# Altium schematic sheet Sheet1.SchDoc
size A2
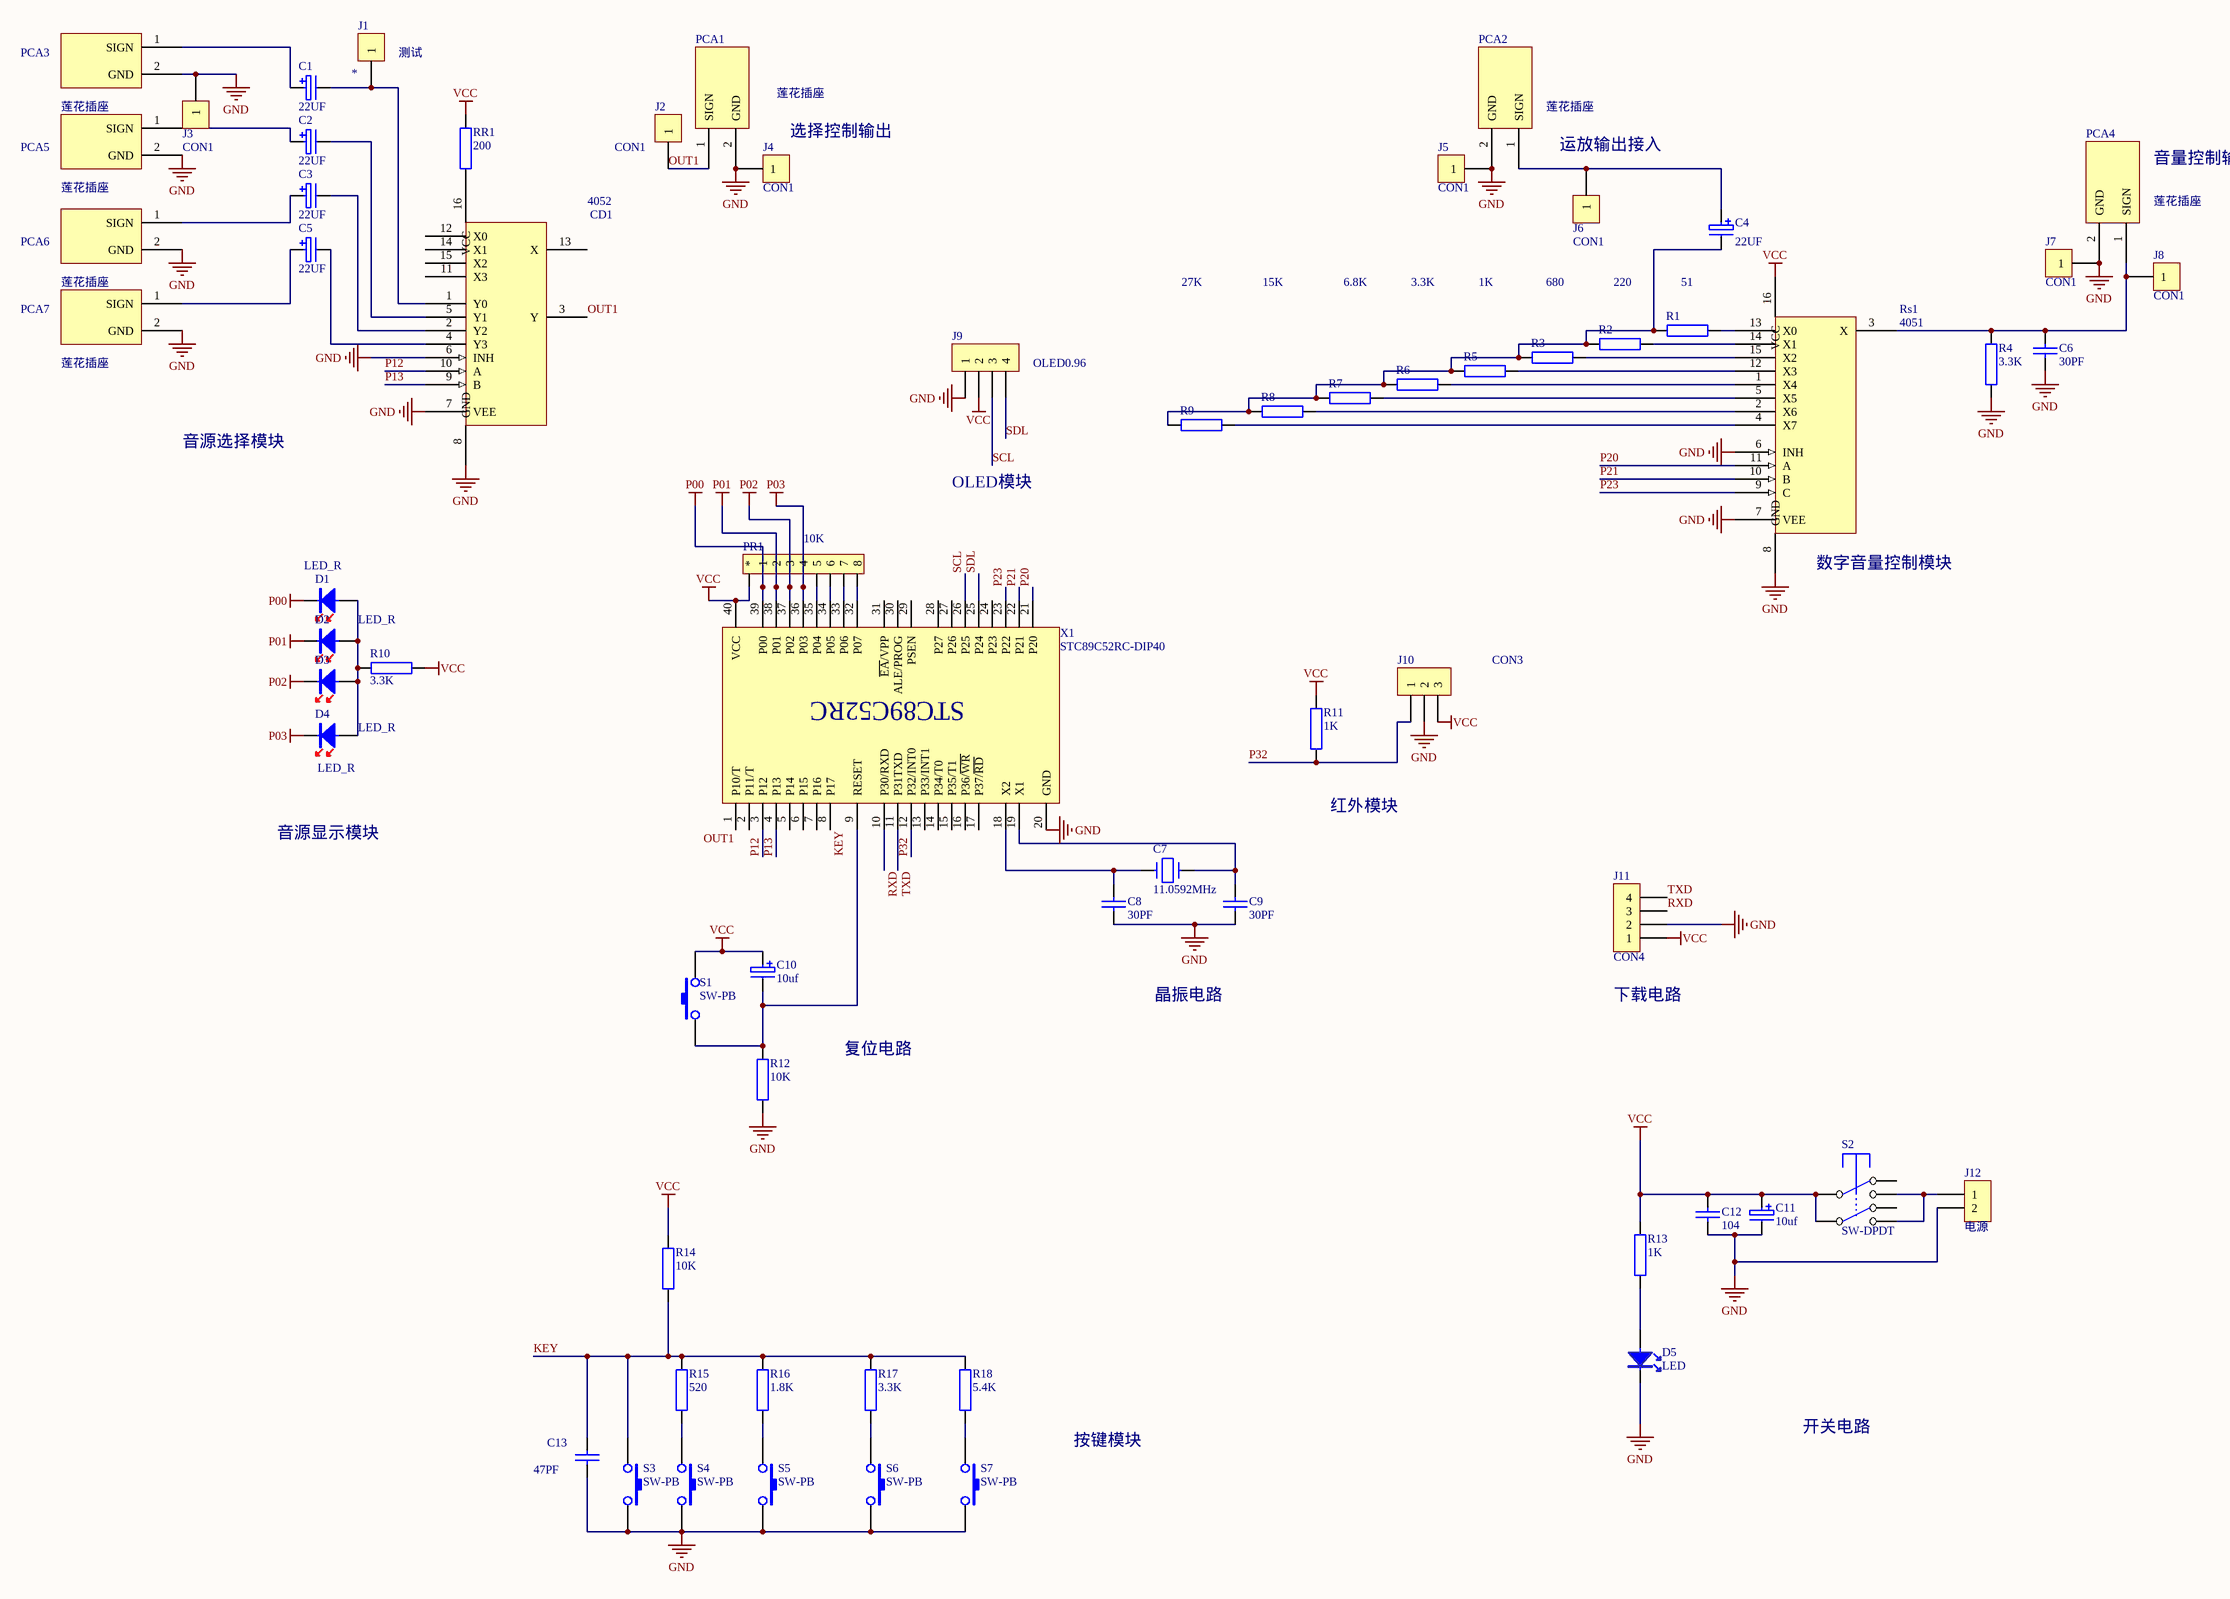
[diagram p0: Sheet1.SchDoc]

## Parts
C1  22UF  [CAO2]
C2  22UF  [CAO2]
C3  22UF  [CAO2]
C4  22UF  [CAO2]
C5  22UF  [CAO2]
C6  30PF  [CAP2]
C7  11.0592MHz  [XTAL1]
C8  30PF  [CAP2]
C9  30PF  [CAP2]
C10  10uf  [CAO2]
C11  10uf  [CAO2]
C12  104  [CAP2]
C13  47PF  [CAP2]
CD1  4052  [SO-16]
D1  LED_R  [LED2_B]
D2  LED_R  [LED2_B]
D3  LED_R  [LED2_B]
D4  LED_R  [LED2_B]
D5  LED  [LED2_B]
J1  *  [SIP-1]
J2  CON1  [SIP-1]
J3  CON1  [SIP-1]
J4  CON1  [SIP-1]
J5  CON1  [SIP-1]
J6  CON1  [SIP-1]
J7  CON1  [SIP-1]
J8  CON1  [SIP-1]
J9  OLED0.96  [sip-4]
J10  CON3  [sip-3]
J11  CON4  [sip-4]
J12  电源  [接线端子]
PCA1  莲花插座  [莲花母座]
PCA2  莲花插座  [莲花母座]
PCA3  莲花插座  [莲花母座]
PCA4  莲花插座  [莲花母座]
PCA5  莲花插座  [莲花母座]
PCA6  莲花插座  [莲花母座]
PCA7  莲花插座  [莲花母座]
PR1  10K  [RP1]
R1  51  [AXIAL0.4]
R2  220  [AXIAL0.4]
R3  680  [AXIAL0.4]
R4  3.3K  [AXIAL0.4]
R5  1K  [AXIAL0.4]
R6  3.3K  [AXIAL0.4]
R7  6.8K  [AXIAL0.4]
R8  15K  [AXIAL0.4]
R9  27K  [AXIAL0.4]
R10  3.3K  [AXIAL0.4]
R11  1K  [AXIAL0.4]
R12  10K  [AXIAL0.4]
R13  1K  [AXIAL0.4]
R14  10K  [AXIAL0.4]
R15  520  [AXIAL0.4]
R16  1.8K  [AXIAL0.4]
R17  3.3K  [AXIAL0.4]
R18  5.4K  [AXIAL0.4]
RR1  200  [AXIAL0.4]
Rs1  4051  [SO-16]
S1  SW-PB  [SW6*6]
S2  SW-DPDT  [SWH8*8]
S3  SW-PB  [SW6*6]
S4  SW-PB  [SW6*6]
S5  SW-PB  [SW6*6]
S6  SW-PB  [SW6*6]
S7  SW-PB  [SW6*6]
X1  STC89C52RC-DIP40  [DIP-40]

## Nets
GND: C6.2 C8.2 C9.2 C11.2 C12.2 C13.2 CD1.6(INH) CD1.7(VEE) CD1.8(GND) D5.2 J3.1 J4.1 J5.1 J7.1 J9.1 J10.2 J11.2 J12.2 PCA1.2(GND) PCA2.2(GND) PCA3.2(GND) PCA4.2(GND) PCA5.2(GND) PCA6.2(GND) PCA7.2(GND) R4.1 R12.1 Rs1.6(INH) Rs1.7(VEE) Rs1.8(GND) S3.2 S4.2 S5.2 S6.2 S7.2 X1.20(GND)
P00: D1.2 PR1.2(1) X1.39(P00)
P01: D2.2 PR1.3(2) X1.38(P01)
P02: D3.2 PR1.4(3) X1.37(P02)
P03: D4.2 PR1.5(4) X1.36(P03)
VCC: C10.1 C11.1 C12.1 J9.2 J10.3 J11.1 PR1.1 R10.1 R11.2 R13.2 R14.2 RR1.1 Rs1.16(VCC) S1.2 S2.2 S2.5 X1.40(VCC)
KEY: C13.1 R14.1 R15.2 R16.2 R17.2 R18.2 S3.1 X1.8(P17)
OUT1: CD1.3(Y) J2.1 PCA1.1(SIGN) X1.1(P10/T)
P12: CD1.10(A) X1.3(P12)
P13: CD1.9(B) X1.4(P13)
P20: Rs1.11(A) X1.21(P20)
P21: Rs1.10(B) X1.22(P21)
P23: Rs1.9(C) X1.23(P22)
P32: J10.1 R11.1 X1.12(P32/INT0)
RXD: J11.3 X1.10(P30/RXD)
SCL: J9.3 X1.26(P25)
SDL: J9.4 X1.25(P24)
TXD: J11.4 X1.11(P31TXD)
NetC1_1: C1.1 PCA3.1(SIGN)
NetC1_2: C1.2 CD1.1(Y0) J1.1
NetC2_1: C2.1 PCA5.1(SIGN)
NetC2_2: C2.2 CD1.5(Y1)
NetC3_1: C3.1 PCA6.1(SIGN)
NetC3_2: C3.2 CD1.2(Y2)
NetC4_1: C4.1 J6.1 PCA2.1(SIGN)
NetC4_2: C4.2 R1.1 R2.1 R3.1 R5.1 R6.1 R7.1 R8.1 R9.1
NetC5_1: C5.1 PCA7.1(SIGN)
NetC5_2: C5.2 CD1.4(Y3)
NetC6_1: C6.1 J8.1 PCA4.1(SIGN) R4.2 Rs1.3(X)
NetC7_1: C7.1 C8.1 X1.18(X2)
NetC7_2: C7.2 C9.1 X1.19(X1)
NetC10_2: C10.2 R12.2 S1.1 X1.9(RESET)
NetCD1_16: CD1.16(VCC) RR1.2
NetD1_1: D1.1 D2.1 D3.1 D4.1 R10.2
NetD5_1: D5.1 R13.1
NetJ12_1: J12.1 S2.3 S2.4
NetPR1_6: PR1.6(5) X1.35(P04)
NetPR1_7: PR1.7(6) X1.34(P05)
NetPR1_8: PR1.8(7) X1.33(P06)
NetPR1_9: PR1.9(8) X1.32(P07)
NetR1_2: R1.2 Rs1.13(X0)
NetR2_2: R2.2 Rs1.14(X1)
NetR3_2: R3.2 Rs1.15(X2)
NetR5_2: R5.2 Rs1.12(X3)
NetR6_2: R6.2 Rs1.1(X4)
NetR7_2: R7.2 Rs1.5(X5)
NetR8_2: R8.2 Rs1.2(X6)
NetR9_2: R9.2 Rs1.4(X7)
NetR15_1: R15.1 S4.1
NetR16_1: R16.1 S5.1
NetR17_1: R17.1 S6.1
NetR18_1: R18.1 S7.1

Not connected (* = marked no-connect by the designer): CD1 11(X3) 12(X0) 13(X) 14(X1) 15(X2); S2 1 6; X1 2(P11/T) 5(P14) 6(P15) 7(P16) 13(P33/INT1) 14(P34/T0) 15(P35/T1) 16(P36/~{WR}) 17(P37/~{RD}) 24(P23) 27(P26) 28(P27) 29(PSEN) 30(ALE/PROG) 31(~{EA}/VPP)

## Notes on the sheet
- 选择控制输出
- 运放输出接入
- 音量控制输出
- 音源选择模块
- OLED模块
- (near Rs1) 数字音量控制模块
- 音源显示模块
- (near R11) 红外模块
- 晶振电路
- (near J11) 下载电路
- 复位电路
- 按键模块
- 开关电路
- (in symbol STC89C52RC-DIP40) STC89C52RC

## Library data of the parts
C1-C5 C10 C11 = CAP3
C6 C8 C9 C12 C13 = CAP1
C7 = CPY
J1-J8 = CON1: Connector
  J1: 测试: 测试
J9 J11 = CON4: Connector
J10 = CON3: Connector
J12 = CON2: Connector
PCA1-PCA7 = PCA
PR1 = PRES1
R1-R18 RR1 = RES: 电阻